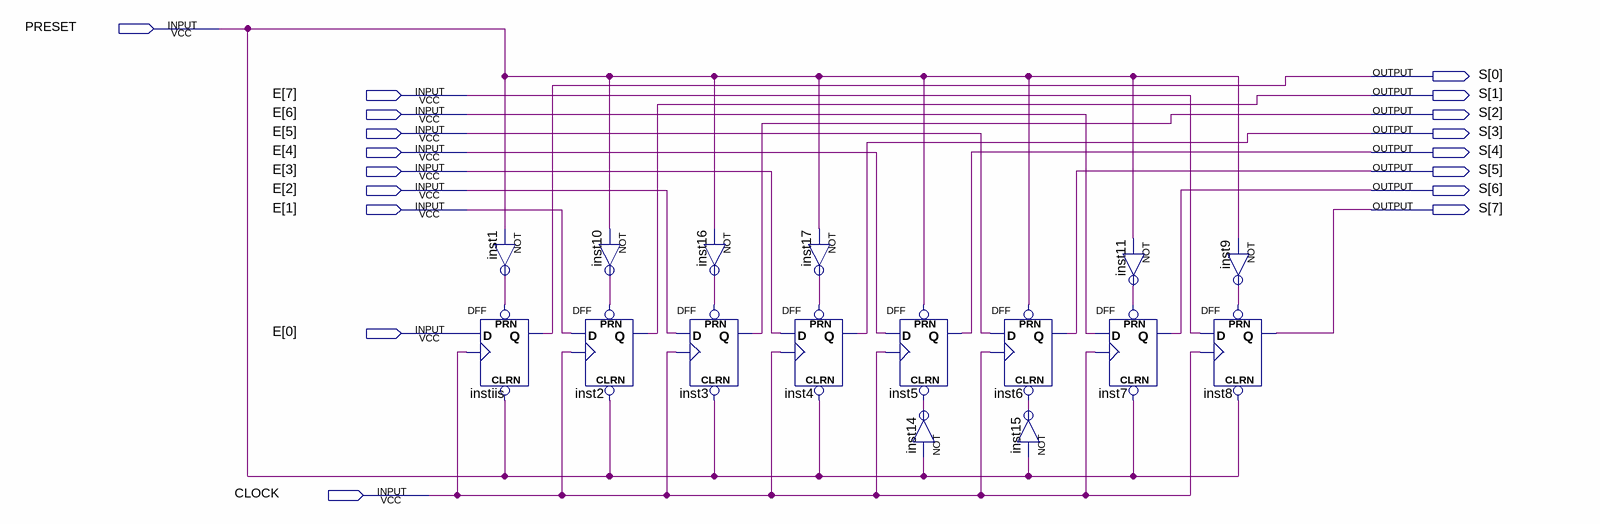
[diagram p0: schematic sheet]
// Quartus schematic linha_13.bdf as structural Verilog: 16 symbols, 18 pins
module linha_13 (
  input  PRESET,
  input  [7:0] E,
  input  CLOCK,
  output [7:0] S
);

  wire inst1_out, inst9_out, inst10_out, inst11_out, inst14_out, inst15_out, inst16_out, inst17_out;

  not inst1 (inst1_out, PRESET);
  DFF instiis (.CLRN(PRESET), .CLK(CLOCK), .D(E[0]), .PRN(inst1_out), .Q(S[0]));
  not inst10 (inst10_out, PRESET);
  DFF inst2 (.CLRN(PRESET), .CLK(CLOCK), .D(E[1]), .PRN(inst10_out), .Q(S[1]));
  not inst16 (inst16_out, PRESET);
  DFF inst3 (.CLRN(PRESET), .CLK(CLOCK), .D(E[2]), .PRN(inst16_out), .Q(S[2]));
  not inst17 (inst17_out, PRESET);
  DFF inst4 (.CLRN(PRESET), .CLK(CLOCK), .D(E[3]), .PRN(inst17_out), .Q(S[3]));
  DFF inst5 (.CLRN(inst14_out), .CLK(CLOCK), .D(E[4]), .PRN(PRESET), .Q(S[4]));
  not inst14 (inst14_out, PRESET);
  DFF inst6 (.CLRN(inst15_out), .CLK(CLOCK), .D(E[5]), .PRN(PRESET), .Q(S[5]));
  not inst15 (inst15_out, PRESET);
  not inst11 (inst11_out, PRESET);
  DFF inst7 (.CLRN(PRESET), .CLK(CLOCK), .D(E[6]), .PRN(inst11_out), .Q(S[6]));
  not inst9 (inst9_out, PRESET);
  DFF inst8 (.CLRN(PRESET), .CLK(CLOCK), .D(E[7]), .PRN(inst9_out), .Q(S[7]));
endmodule
